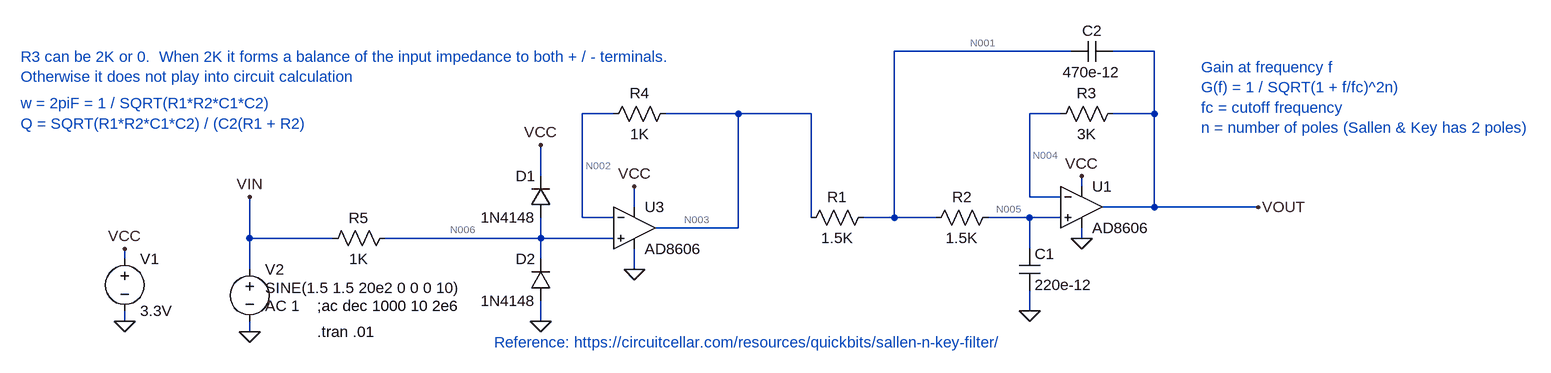
[diagram p0: schematic Sallen & Key LPF_Transient.asc]
Sallen & Key LPF_Transient.asc, the LTspice schematic file:
Version 4
SHEET 1 1228 680
WIRE 480 -48 208 -48
WIRE 608 -48 544 -48
WIRE -224 48 -272 48
WIRE -32 48 -144 48
WIRE 80 48 -32 48
WIRE 464 48 416 48
WIRE 608 48 608 -48
WIRE 608 48 544 48
WIRE -336 144 -336 96
WIRE 496 160 496 144
WIRE 416 176 416 48
WIRE 464 176 416 176
WIRE -192 192 -192 160
WIRE 608 192 608 48
WIRE 608 192 528 192
WIRE 768 192 608 192
WIRE -272 208 -272 48
WIRE -224 208 -272 208
WIRE 80 208 80 48
WIRE 208 208 208 -48
WIRE 208 208 160 208
WIRE 272 208 208 208
WIRE 416 208 352 208
WIRE 464 208 416 208
WIRE -32 224 -32 48
WIRE -32 224 -160 224
WIRE -784 240 -784 176
WIRE -656 240 -784 240
WIRE -336 240 -336 208
WIRE -336 240 -576 240
WIRE -224 240 -336 240
WIRE 496 240 496 224
WIRE 416 256 416 208
WIRE -976 272 -976 256
WIRE -336 272 -336 240
WIRE -784 288 -784 240
WIRE -192 288 -192 256
WIRE 416 352 416 320
WIRE -976 368 -976 352
WIRE -336 368 -336 336
WIRE -784 384 -784 368
FLAG -976 368 0
FLAG -976 256 VCC
FLAG -784 384 0
FLAG 416 352 0
FLAG 496 144 VCC
FLAG -784 176 VIN
FLAG 496 240 0
FLAG 768 192 VOUT
FLAG -192 288 0
FLAG -192 160 VCC
FLAG -336 368 0
FLAG -336 96 VCC
SYMBOL voltage -976 256 R0
WINDOW 123 0 0 Left 0
WINDOW 39 0 0 Left 0
SYMATTR InstName V1
SYMATTR Value 3.3V
SYMBOL voltage -784 272 R0
WINDOW 123 24 72 Left 2
WINDOW 39 0 0 Left 0
WINDOW 3 24 44 Left 2
SYMATTR Value2 AC 1
SYMATTR Value SINE(1.5 1.5 20e2 0 0 0 10)
SYMATTR InstName V2
SYMBOL res 560 32 R90
WINDOW 0 0 56 VBottom 2
WINDOW 3 32 56 VTop 2
SYMATTR InstName R3
SYMATTR Value 3K
SYMBOL res 368 192 R90
WINDOW 0 0 56 VBottom 2
WINDOW 3 32 56 VTop 2
SYMATTR InstName R2
SYMATTR Value 1.5K
SYMBOL res 176 192 R90
WINDOW 0 0 56 VBottom 2
WINDOW 3 32 56 VTop 2
SYMATTR InstName R1
SYMATTR Value 1.5K
SYMBOL cap 400 256 R0
SYMATTR InstName C1
SYMATTR Value 220e-12
SYMBOL cap 544 -64 R90
WINDOW 0 0 32 VBottom 2
WINDOW 3 32 32 VTop 2
SYMATTR InstName C2
SYMATTR Value 470e-12
SYMBOL res -128 32 R90
WINDOW 0 0 56 VBottom 2
WINDOW 3 32 56 VTop 2
SYMATTR InstName R4
SYMATTR Value 1K
SYMBOL res -560 224 R90
WINDOW 0 0 56 VBottom 2
WINDOW 3 32 56 VTop 2
SYMATTR InstName R5
SYMATTR Value 1K
SYMBOL OpAmps\\AD8606 -192 160 R0
SYMATTR InstName U3
SYMBOL OpAmps\\AD8606 496 128 R0
SYMATTR InstName U1
SYMBOL diode -320 208 R180
WINDOW 0 24 64 Left 2
WINDOW 3 24 0 Left 2
SYMATTR InstName D1
SYMATTR Value 1N4148
SYMBOL diode -320 336 R180
WINDOW 0 24 64 Left 2
WINDOW 3 24 0 Left 2
SYMATTR InstName D2
SYMATTR Value 1N4148
TEXT -680 384 Left 2 !.tran .01
TEXT -680 344 Left 2 !;ac dec 1000 10 2e6
TEXT -1136 -40 Left 2 ;R3 can be 2K or 0.  When 2K it forms a balance of the input impedance to both + / - terminals.\nOtherwise it does not play into circuit calculation
TEXT -1136 32 Left 2 ;w = 2piF = 1 / SQRT(R1*R2*C1*C2)\nQ = SQRT(R1*R2*C1*C2) / (C2(R1 + R2)
TEXT -408 400 Left 2 ;Reference: https://circuitcellar.com/resources/quickbits/sallen-n-key-filter/
TEXT 680 -24 Left 2 ;Gain at frequency f\nG(f) = 1 / SQRT(1 + f/fc)^2n)\nfc = cutoff frequency\nn = number of poles (Sallen & Key has 2 poles)

The netlist it stands for:
* Sallen & Key LPF_Transient.asc
V1 VCC 0 3.3V
V2 VIN 0 SINE(1.5 1.5 20e2 0 0 0 10) AC 1
R3 VOUT N004 3K
R2 N005 N001 1.5K
R1 N001 N003 1.5K
C1 N005 0 220e-12
C2 VOUT N001 470e-12
R4 N003 N002 1K
R5 N006 VIN 1K
XU3 N006 N002 VCC 0 N003 AD8606  ; pins In+ In- V+ V- OUT
XU1 N005 N004 VCC 0 VOUT AD8606  ; pins In+ In- V+ V- OUT
D1 N006 VCC 1N4148
D2 0 N006 1N4148
.model D D
.lib standard.dio
.tran .01
;ac dec 1000 10 2e6
* R3 can be 2K or 0.  When 2K it forms a balance of the input impedance to both + / - terminals.
* Otherwise it does not play into circuit calculation
* w = 2piF = 1 / SQRT(R1*R2*C1*C2)
* Q = SQRT(R1*R2*C1*C2) / (C2(R1 + R2)
* Reference: https://circuitcellar.com/resources/quickbits/sallen-n-key-filter/
* Gain at frequency f
* G(f) = 1 / SQRT(1 + f/fc)^2n)
* fc = cutoff frequency
* n = number of poles (Sallen & Key has 2 poles)
.lib ADI.lib
.backanno
.end

* Results of the author's LTspice run, read from the files saved beside the schematic
* Operating Point, zero values left out:
*   V(vcc) = 3.3 V
*   V(vin) = 1.5 V
*   V(vout) = 1.5 V
*   V(n004) = 1.5 V
*   V(n005) = 1.5 V
*   V(n001) = 1.5 V
*   V(n003) = 1.5 V
*   V(n002) = 1.5 V
*   V(n006) = 1.5 V
*   I(D2) = -2.521 nA
*   I(D1) = -2.522 nA
*   I(V1) = -920.6 µA
*   Ix(u3:99) = 460.3 µA
*   Ix(u3:50) = -460.3 µA
*   Ix(u1:99) = 460.3 µA
*   Ix(u1:50) = -460.3 µA
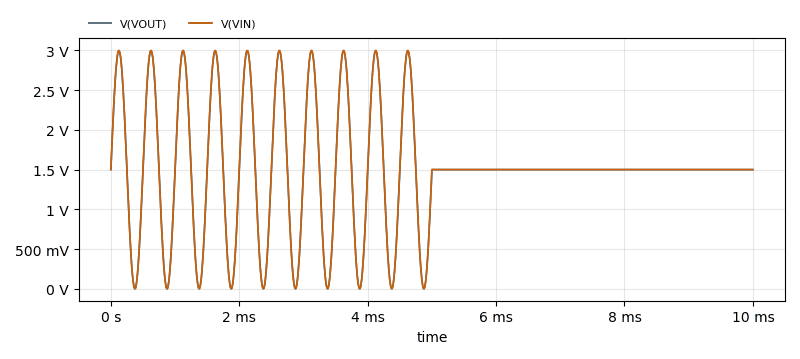
[diagram p1: Transient Analysis of Sallen & Key LPF_Transient.asc, plotted from the saved traces]
* Transient Analysis, 1 run:
*   V(VOUT): min 39.76 µV, max 2.996 V, average 1.5 V, rms 1.676 V, last 1.5 V
*   V(VIN): min 318 nV, max 3 V, average 1.5 V, rms 1.677 V, last 1.5 V